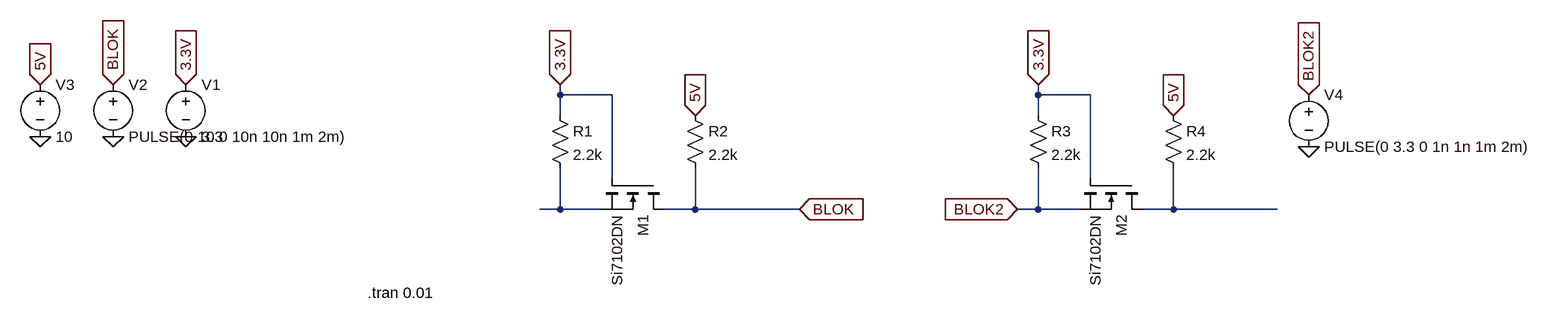
[diagram p0: schematic Level_Shifter.asc]
Level_Shifter.asc, the LTspice schematic file:
Version 4
SHEET 1 1544 680
WIRE 32 -112 32 -128
WIRE 112 -112 32 -112
WIRE 768 -112 768 -128
WIRE 848 -112 768 -112
WIRE 32 -80 32 -112
WIRE 768 -80 768 -112
WIRE 112 16 112 -112
WIRE 848 16 848 -112
WIRE 32 64 32 0
WIRE 32 64 0 64
WIRE 96 64 32 64
WIRE 240 64 240 0
WIRE 240 64 192 64
WIRE 400 64 240 64
WIRE 768 64 768 0
WIRE 768 64 736 64
WIRE 832 64 768 64
WIRE 976 64 976 0
WIRE 976 64 928 64
WIRE 1136 64 976 64
FLAG -544 -48 0
FLAG -656 -48 0
FLAG -656 -128 BLOK
IOPIN -656 -128 In
FLAG -544 -128 3.3V
IOPIN -544 -128 In
FLAG 240 -80 5V
IOPIN 240 -80 In
FLAG 32 -128 3.3V
IOPIN 32 -128 In
FLAG 400 64 BLOK
IOPIN 400 64 In
FLAG -768 -48 0
FLAG -768 -128 5V
IOPIN -768 -128 In
FLAG 976 -80 5V
IOPIN 976 -80 In
FLAG 768 -128 3.3V
IOPIN 768 -128 In
FLAG 736 64 BLOK2
IOPIN 736 64 In
FLAG 1184 -32 0
FLAG 1184 -112 BLOK2
IOPIN 1184 -112 In
SYMBOL nmos 192 16 R90
SYMATTR InstName M1
SYMATTR Value Si7102DN
SYMBOL voltage -544 -144 R0
WINDOW 123 0 0 Left 0
WINDOW 39 0 0 Left 0
SYMATTR InstName V1
SYMATTR Value 3.3
SYMBOL res 16 -96 R0
SYMATTR InstName R1
SYMATTR Value 2.2k
SYMBOL res 224 -96 R0
SYMATTR InstName R2
SYMATTR Value 2.2k
SYMBOL voltage -656 -144 R0
WINDOW 123 0 0 Left 0
WINDOW 39 0 0 Left 0
SYMATTR InstName V2
SYMATTR Value PULSE(0 10 0 10n 10n 1m 2m)
SYMBOL voltage -768 -144 R0
WINDOW 123 0 0 Left 0
WINDOW 39 0 0 Left 0
SYMATTR InstName V3
SYMATTR Value 10
SYMBOL nmos 928 16 R90
SYMATTR InstName M2
SYMATTR Value Si7102DN
SYMBOL res 752 -96 R0
SYMATTR InstName R3
SYMATTR Value 2.2k
SYMBOL res 960 -96 R0
SYMATTR InstName R4
SYMATTR Value 2.2k
SYMBOL voltage 1184 -128 R0
WINDOW 123 0 0 Left 0
WINDOW 39 0 0 Left 0
SYMATTR InstName V4
SYMATTR Value PULSE(0 3.3 0 1n 1n 1m 2m)
TEXT -264 192 Left 2 !.tran 0.01

The netlist it stands for:
* Level_Shifter.asc
M1 BLOK 3.3V N001 N001 Si7102DN
V1 3.3V 0 3.3
R1 3.3V N001 2.2k
R2 5V BLOK 2.2k
V2 BLOK 0 PULSE(0 10 0 10n 10n 1m 2m)
V3 5V 0 10
M2 N002 3.3V BLOK2 BLOK2 Si7102DN
R3 3.3V BLOK2 2.2k
R4 5V N002 2.2k
V4 BLOK2 0 PULSE(0 3.3 0 1n 1n 1m 2m)
.model NMOS NMOS
.model PMOS PMOS
.lib standard.mos
.tran 0.01
.backanno
.end